# EasyEDA Pro project ProProject_EdgDbg-v1_2024-04-02.epro

# Schematic st-link  v2-1_1
Create Date: 2024-04-01; Page Name: ST-LINK V2-1; Project Name: EdgDbg-v1; Schematic Name: st-link  v2-1_1; Update Date: 2024-04-01; Company: 攻城狮晨哲; Drawed: 沈工; Page Size: A4; Part Number: PCB-002; Reviewed: 沈工; Version: V2.0.1
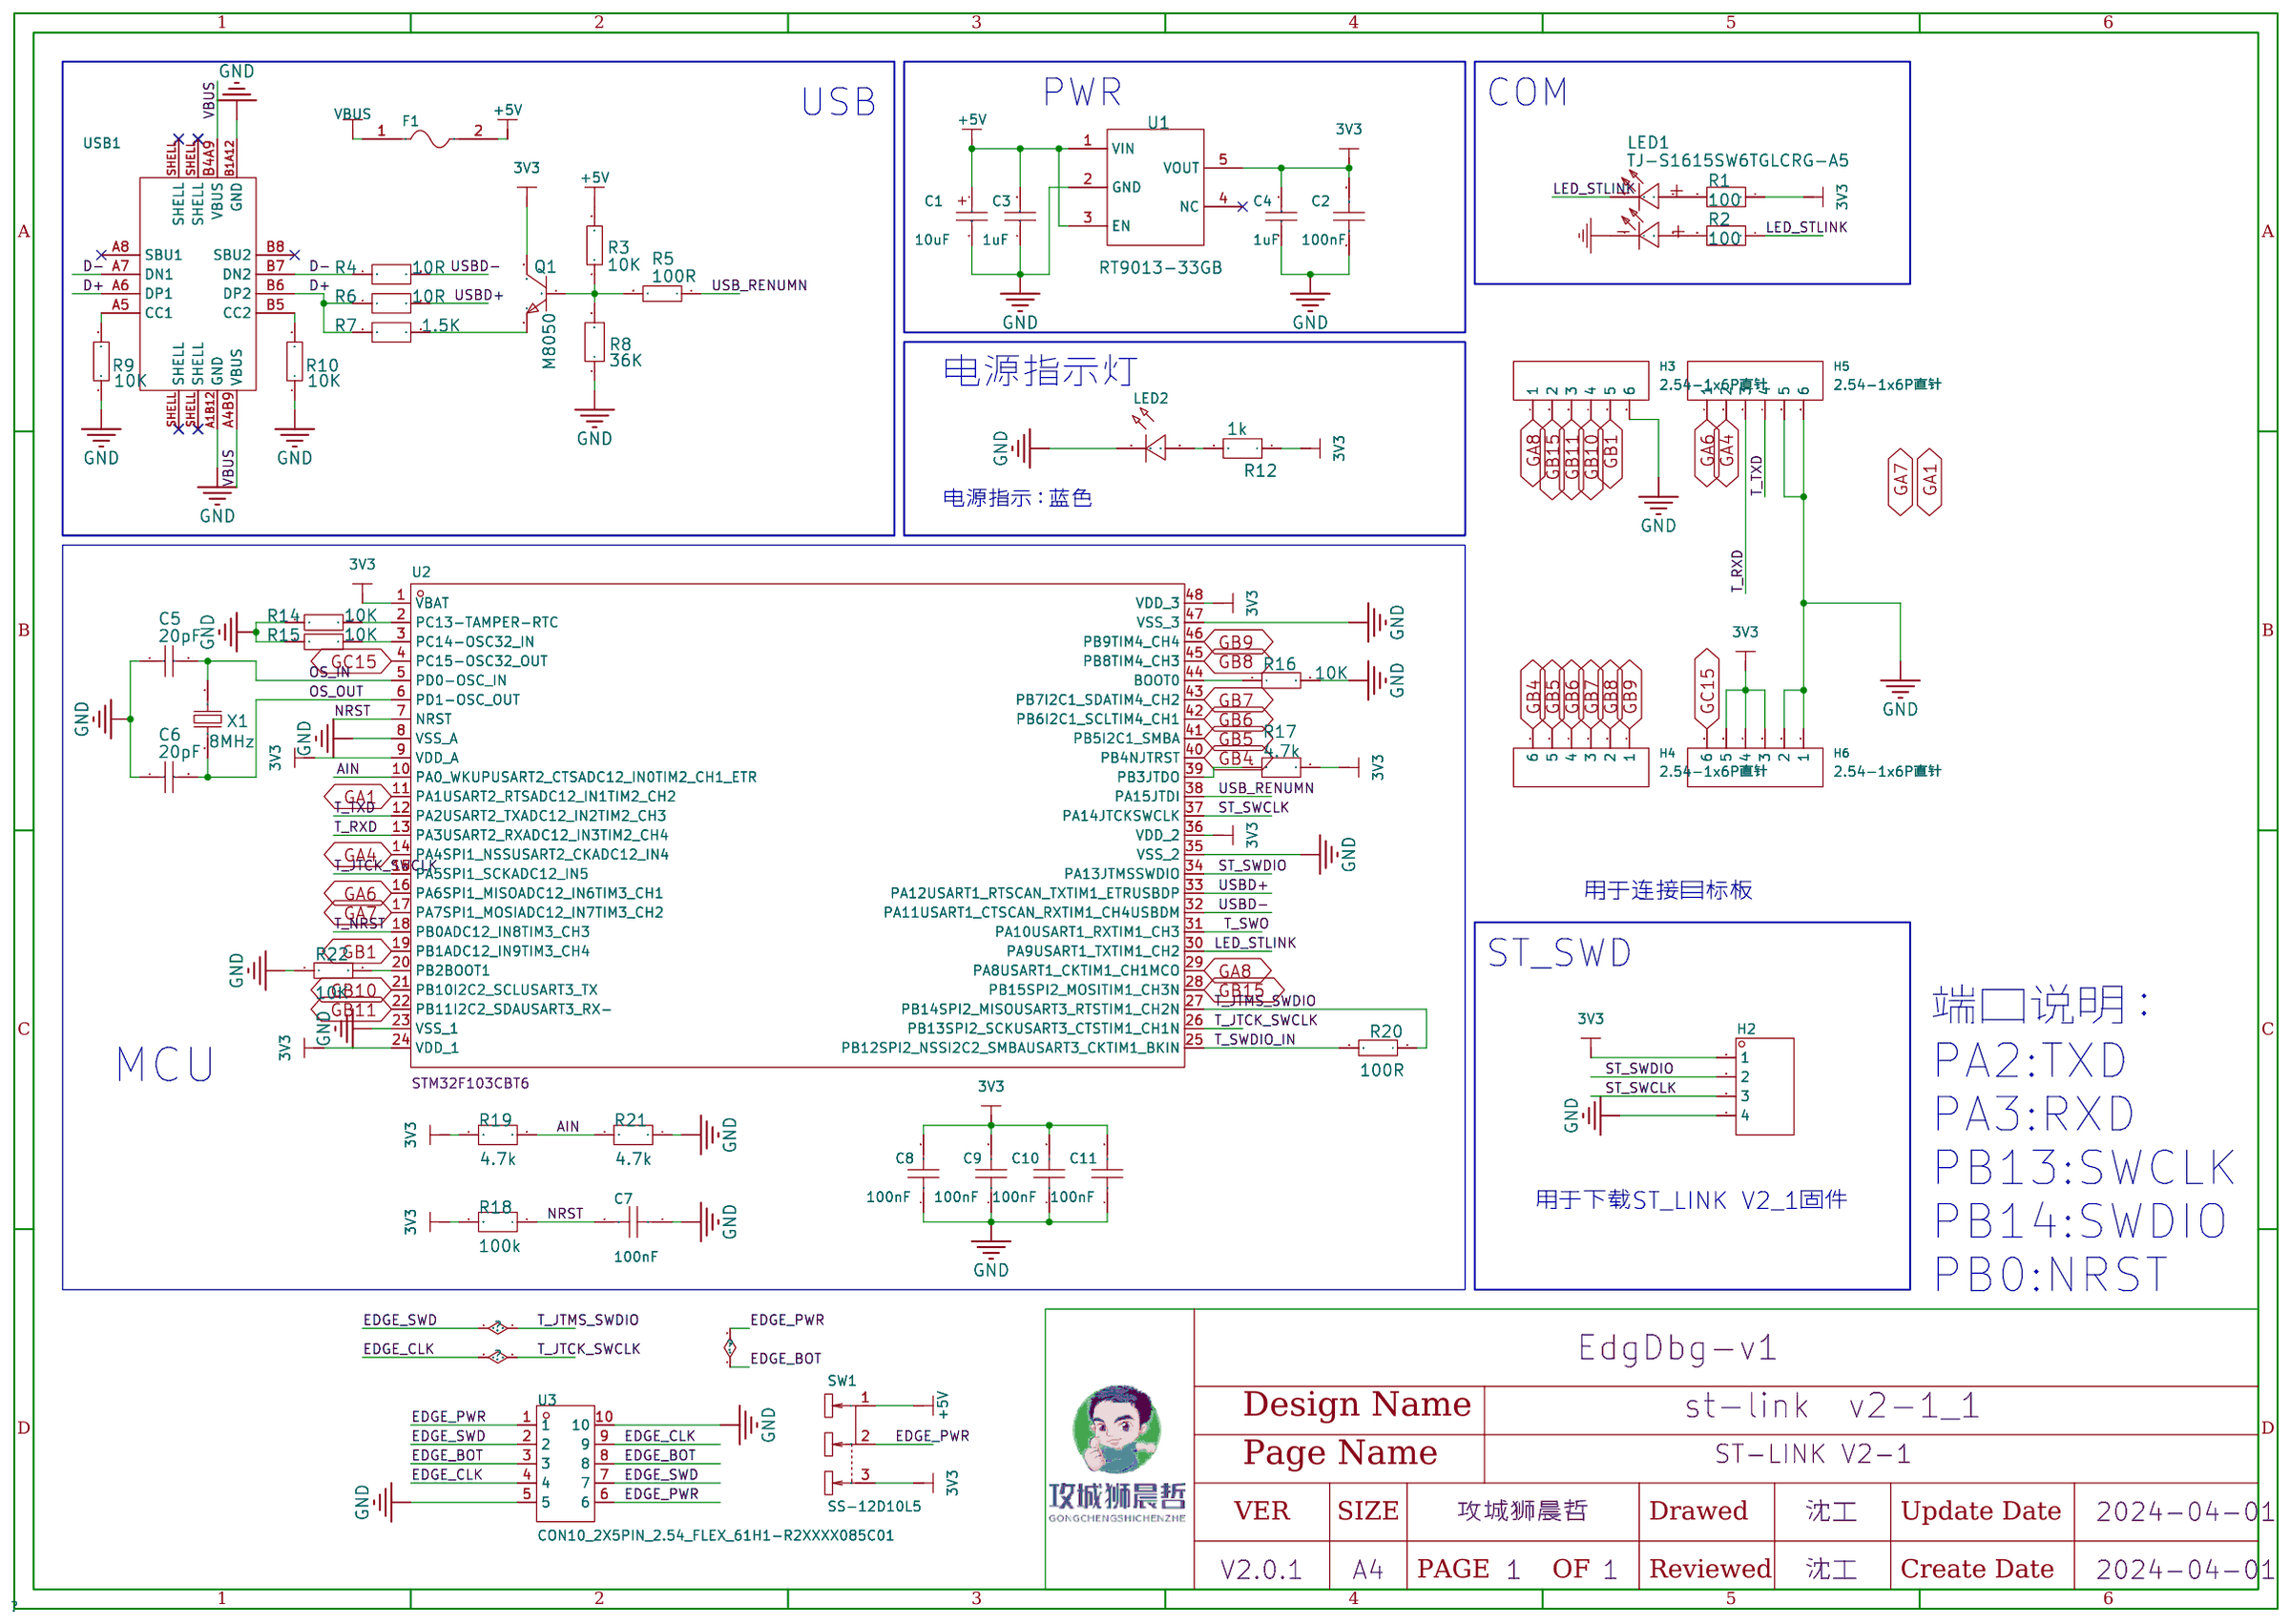
[diagram p0: schematic sheet]

## Parts
C1  10uF  [CASE-A_3216]
C2  100nF  [C0603]
C3  1uF  [C0603]
C4  1uF  [C0603]
C5  20pF  [C0603]
C6  20pF  [C0603]
C7  100nF  [C0603]
C8  100nF  [C0603]
C9  100nF  [C0603]
C10  100nF  [C0603]
C11  100nF  [C0603]
F1  nSMD050  [F1206]
H2  -  [HDR-TH_4P-P2.54-V-M]
H3  2.54-1x6P直针  [HDR-TH_6P-P2.54-V-M-1]
H4  2.54-1x6P直针  [HDR-TH_6P-P2.54-V-M-1]
H5  2.54-1x6P直针  [HDR-TH_6P-P2.54-V-M-1]
H6  2.54-1x6P直针  [HDR-TH_6P-P2.54-V-M-1]
LED1  TJ-S1615SW6TGLCRG-A5  [LED-ARRAY-SMD_4P-L1.6-W1.5-TR-RD_TJ-S1615SW6TGLCRB-A5]
LED2  -  [LED0603]
Q1  M8050  [SOT-23(SOT-23-3)]
R1  100  [R0603]
R2  100  [R0603]
R3  10K  [R0603]
R4  10R  [R0603]
R5  100R  [R0603]
R6  10R  [R0603]
R7  1.5K  [R0603]
R8  36K  [R0603]
R9  10K  [R0603]
R10  10K  [R0603]
R12  1k  [R0603]
R14  10K  [R0603]
R15  10K  [R0603]
R16  10K  [R0603]
R17  4.7k  [R0603]
R18  100k  [R0603]
R19  4.7k  [R0603]
R20  100R  [R0603]
R21  4.7k  [R0603]
R22  10K  [R0603]
SW1  SS-12D10L5  [SW-TH_SS-12D10L5]
U1  RT9013-33GB  [SOT-23-5_L3.0-W1.7-P0.95-LS2.8-BR]
U2  -  [LQFP-48_L7.0-W7.0-P0.50-LS9.0-BL]
U3  CON10_2X5PIN_2.54_FLEX_61H1-R2XXXX085C01  [CONN-TH_10P-P2.54-2X5PIN_2.54_FLEX_61H1]
USB1  -  [USB-3.1-SMD_U262-161N-4BVC11]
X1  8MHz  [OSC-SMD_L5.0-W3.2]

## Library data of the parts
C1 = TAJA106K016RNJ: 容值:10uF;精度:±10%;额定电压:16V;等效串联电阻:3Ω@100kHz;工作温度:-55~+125;; LCSC Part Name: 10uF ±10% 16V; Supplier Part: C7171; Manufacturer: Kyocera AVX; JLCPCB Part Class: Basic Part; Datasheet: https://atta.szlcsc.com/upload/public/pdf/source/20160107/1457707748093.pdf; Supplier: LCSC; Tolerance: ±10%; Rated Voltage: 16V; Equivalent Series Resistance(ESR): 3Ω@100kHz; Operating Temperature: -55~+125
C2 C7-C11 = CC0603KRX7R9BB104: 容值:100nF;精度:±10%;额定电压:50V;温度系数:X7R;; LCSC Part Name: 100nF ±10% 50V; Supplier Part: C14663; Manufacturer: YAGEO(国巨); Supplier Footprint: 0603; JLCPCB Part Class: Basic Part; Datasheet: https://atta.szlcsc.com/upload/public/pdf/source/20170116/1484561234239.pdf; Supplier: LCSC; Tolerance: ±10%; Voltage Rated: 50V; Temperature Coefficient: X7R
C3 C4 = CL10A105KB8NNNC: 容值:1uF;精度:±10%;额定电压:50V;温度系数:X5R;; LCSC Part Name: 1uF ±10% 50V; Supplier Part: C15849; Manufacturer: SAMSUNG(三星); Supplier Footprint: 0603; JLCPCB Part Class: Basic Part; Datasheet: https://atta.szlcsc.com/upload/public/pdf/source/20160103/1457707679084.pdf; Supplier: LCSC; Tolerance: ±10%; Voltage Rated: 50V; Temperature Coefficient: X5R
C5 C6 = 20pF: Supplier: LCSC; Manufacturer Part: CL10C220JB8NNNC; Manufacturer: SAMSUNG; Supplier Part: C1653
F1 = nSMD050: 最大电压:6V;最大电流:100A;保持电流:500mA;跳闸电流:1A;; LCSC Part Name: 0.5A 6V  自恢复保险丝; Supplier Part: C69688; Manufacturer: 台湾陆海; Supplier Footprint: 1206; JLCPCB Part Class: Extended Part; Datasheet: https://atta.szlcsc.com/upload/public/pdf/source/20160331/1459396375403.pdf; Supplier: LCSC; Operating Voltage (Max): 6V; Current Rating (Max): 100A; Hold Current: 500mA; Trip Current: 1A
H2 = B-2100S04P-A110: 间距:2.54mm;总PIN位数:4;排数:1;插针结构:1x4P;行距:-;安装类型:直插;圆针/方针:-;额定电流:-;额定电压:-;配合针长度:6mm;塑高:2.54mm;端接针长度:3mm;触头材质:黄铜;触头镀层:-;工作温度范围:-40~+105;颜色:黑色;; LCSC Part Name: 2.54mm 1x4P; Supplier Part: C124378; Manufacturer: Ckmtw(灿科盟); Supplier Footprint: 插件,P=2.54mm; JLCPCB Part Class: Extended Part; Datasheet: https://atta.szlcsc.com/upload/public/pdf/source/20170821/C124378_1503303307508901532.pdf; Supplier: LCSC; Pitch: 2.54mm; Number of Pins: 4; Number of Rows: 1; Pin Structure: 1x4P; Mounting Type: 直插; Length of Mating Pin: 6mm; Insulation Height: 2.54mm; Length of End Connection Pin: 3mm; Contact Material: 黄铜; Operating Temperature Range: -40~+105; Color: 黑色
H3-H6 = 2.54-1x6P直针: 插针结构:1x6P;间距:2.54mm;行距:-;圆针/方针:方针;安装类型:直插;排数:单排;总PIN位数:6P;额定电流:3A;额定电压:-;配合针长度:-;塑高:-;触头材质:黄铜;触头镀层:-;工作温度范围:-40℃~+105℃;颜色:黑色;; LCSC Part Name: 间距:2.54mm 1x6P 直插 方针; Supplier Part: C37208; Manufacturer: BOOMELE(博穆精密); Supplier Footprint: 插件,P=2.54mm; JLCPCB Part Class: 扩展库; Supplier: LCSC; Pin Structure: 1x6P; Pitch: 2.54mm; Circluar Pins/Square Pins: 方针; Mounting Type: 直插; Number of Rows: 单排; Number of Pins: 6P; Current Rating (Max): 3A; Contact Material: 黄铜; Operating Temperature Range: -40℃~+105℃; Color: 黑色
LED1 = TJ-S1615SW6TGLCRG-A5: Supplier: LCSC; Supplier Part: C273605; Manufacturer: TOGIALED
LED2 = LED-0603-B
Q1 = M8050_C266599: Supplier: LCSC; Supplier Part: C266599; Manufacturer: Bourne Semicon (Shenzhen)
R1 R2 R12 = 1k: Manufacturer Part: RC0603FR-071KL; Supplier: LCSC; Manufacturer: YAGEO; Supplier Part: C22548
R3 R9 R10 R14-R16 R22 = 10K: Supplier: LCSC; Manufacturer: YAGEO; Manufacturer Part: AC0603FR-0710KL; Supplier Part: C116677
R4 R6 = 10R: Manufacturer Part: RC0603FR-0710RL; Supplier: LCSC; Manufacturer: YAGEO; Supplier Part: C109318
R5 R20 = 100R: Supplier: LCSC; Supplier Part: C105588; Manufacturer: YAGEO; Manufacturer Part: RC0603FR-07100RL
R7 = 1.5K: Manufacturer Part: RC0603FR-071K5L; Supplier: LCSC; Manufacturer: YAGEO; Supplier Part: C114668
R8 = 36K: Manufacturer Part: AC0603FR-0736KL; Supplier: LCSC; Manufacturer: YAGEO; Supplier Part: C227841
R17 R19 R21 = 4.7k: Manufacturer Part: AC0603FR-074K7L; Supplier: LCSC; Manufacturer: YAGEO; Supplier Part: C116697
R18 = 100k: Manufacturer Part: AC0603FR-07100KL; Supplier: LCSC; Manufacturer: YAGEO; Supplier Part: C116674
SW1 = SS-12D10L5: 电路结构:单刀双掷;安装方式:直插;开关颜色:黑色;额定电流(DC):3A;额定电压(DC):125V;额定电流(AC):3A;额定电压(AC):125V;机械寿命:1万次;; LCSC Part Name: 柄长5mm 直插双档 滑动开关; Supplier Part: C319012; Manufacturer: XKB Connectivity(中国星坤); Supplier Footprint: 插件; JLCPCB Part Class: 扩展库; Datasheet: https://atta.szlcsc.com/upload/public/pdf/source/20211009/D6412F37AABE6F9459A6EE7FA4DAEADB.pdf; Supplier: LCSC; Circuit: 单刀双掷; Actuator Style: 矩形柱状; Pin Style: PC引脚; Switch Length: 13mm; Switch Width: 6.8mm; Switch Height: 6.4mm; Mounting Style: 直插; Actuator Color: 黑色; Current Rating (DC): 3A; Voltage Rating (DC): 125V; Current Rating (AC): 3A; Voltage Rating (AC): 125V; Mechanical Life: 1万次; Operating Temperature: -40℃~+85℃
U1 = RT9013-33GB: Supplier: LCSC; Manufacturer: RICHTEK; image: //image.lceda.cn/szlcsc/C47773.jpg; Supplier Part: C47773
U2 = STM32F103CBT6: 主频（MAX):72MHz;工作电压:2V ~ 3.6V;; Supplier Part: C8304; Manufacturer: ST(意法半导体); Supplier Footprint: LQFP-48_7x7x05P; JLCPCB Part Class: Extended Part; Datasheet: https://atta.szlcsc.com/upload/public/pdf/source/20140724/1457707170379.pdf; Supplier: LCSC; Speed: 72MHz; Voltage - Supply (Vcc/Vdd): 2V ~ 3.6V; RAM Size: 20KB; Number of I/O: 37; A/D: 16x12bit; PWM: 13; UART/USART: 3 USART; I2C（SMBUS/PMBUS）: 2; USB Device: 1; CAN: 1
U3 = CON10_2X5PIN_2.54_FLEX_61H1-R2XXXX085C01: Supplier Part: C9900013345; Supplier Footprint: 2X5PIN_2.54_FLEX_61H1; JLCPCB Part Class: 扩展库; Supplier: LCSC
USB1 = U262-161N-4BVC11: 连接器类型:Type-C;标准:-;公母:母座;触点数量:16;端口数量:1;; LCSC Part Name: Type-C 母座; Supplier Part: C319148; Manufacturer: XKB Connectivity(中国星坤); Supplier Footprint: SMD; JLCPCB Part Class: Extended Part; Datasheet: https://atta.szlcsc.com/upload/public/pdf/source/20211015/B478CBA0F1623DA36A6CC6918C49C838.pdf; Supplier: LCSC; Connector Type: Type-C; Gender: 母座; Number of Contacts: 16; Number of Ports: 1
X1 = 8MHz: Supplier: LCSC; Manufacturer: TXC; Manufacturer Part: 7A0808LCSC-AHK2G; Supplier Part: C111120

## Nets
3V3: C2.2 C4.2 C8.2 C9.2 C10.2 C11.2 H2.1 H6.3 H6.4 H6.5 Q1.3(C) R1.1 R12.1 R17.1 R18.2 R19.2 SW1.3 U1.5(VOUT) U2.1(VBAT) U2.9(VDD_A) U2.24(VDD_1) U2.36(VDD_2) U2.48(VDD_3)
+5V: C1.1 C3.2 F1.2 R3.2 SW1.1 U1.1(VIN) U1.3(EN)
GND: C1.2 C2.1 C3.1 C4.1 C5.1 C6.1 C7.1 C8.1 C9.1 C10.1 C11.1 H2.4 H3.6 H5.5 H5.6 H6.1 H6.2 LED1.4 LED2.1(C) R8.1 R9.1 R10.1 R14.1 R15.1 R16.2 R21.1 R22.1 U1.2(GND) U2.8(VSS_A) U2.23(VSS_1) U2.35(VSS_2) U2.47(VSS_3) U3.5 U3.10 USB1.A1B12(GND) USB1.B1A12(GND)
VBUS: F1.1 USB1.A4B9(VBUS) USB1.B4A9(VBUS)
AIN: R19.1 R21.2 U2.10(PA0_WKUPUSART2_CTSADC12_IN0TIM2_CH1_ETR)
D+: R6.1 R7.1 USB1.A6(DP1) USB1.B6(DP2)
D-: R4.1 USB1.A7(DN1) USB1.B7(DN2)
EDGE_BOT: SW1.2 U3.1 U3.3 U3.6 U3.8
EDGE_CLK: U2.15(PA5SPI1_SCKADC12_IN5) U2.26(PB13SPI2_SCKUSART3_CTSTIM1_CH1N) U3.4 U3.9
EDGE_SWD: R20.1 U2.27(PB14SPI2_MISOUSART3_RTSTIM1_CH2N) U3.2 U3.7
GA1: U2.11(PA1USART2_RTSADC12_IN1TIM2_CH2)
GA4: H5.2 U2.14(PA4SPI1_NSSUSART2_CKADC12_IN4)
GA6: H5.1 U2.16(PA6SPI1_MISOADC12_IN6TIM3_CH1)
GA7: U2.17(PA7SPI1_MOSIADC12_IN7TIM3_CH2)
GA8: H3.1 U2.29(PA8USART1_CKTIM1_CH1MCO)
GB1: H3.5 U2.19(PB1ADC12_IN9TIM3_CH4)
GB4: H4.6 U2.40(PB4NJTRST)
GB5: H4.5 U2.41(PB5I2C1_SMBA)
GB6: H4.4 U2.42(PB6I2C1_SCLTIM4_CH1)
GB7: H4.3 U2.43(PB7I2C1_SDATIM4_CH2)
GB8: H4.2 U2.45(PB8TIM4_CH3)
GB9: H4.1 U2.46(PB9TIM4_CH4)
GB10: H3.4 U2.21(PB10I2C2_SCLUSART3_TX)
GB11: H3.3 U2.22(PB11I2C2_SDAUSART3_RX-)
GB15: H3.2 U2.28(PB15SPI2_MOSITIM1_CH3N)
GC15: H6.6 U2.4(PC15-OSC32_OUT)
LED_STLINK: LED1.2 R2.1 U2.30(PA9USART1_TXTIM1_CH2)
NRST: C7.2 R18.1 U2.7(NRST)
OS_IN: C5.2 U2.5(PD0-OSC_IN) X1.2
OS_OUT: C6.2 U2.6(PD1-OSC_OUT) X1.1
ST_SWCLK: H2.3 U2.37(PA14JTCKSWCLK)
ST_SWDIO: H2.2 U2.34(PA13JTMSSWDIO)
T_NRST: U2.18(PB0ADC12_IN8TIM3_CH3)
T_RXD: H5.3 U2.13(PA3USART2_RXADC12_IN3TIM2_CH4)
T_SWDIO_IN: R20.2 U2.25(PB12SPI2_NSSI2C2_SMBAUSART3_CKTIM1_BKIN)
T_SWO: U2.31(PA10USART1_RXTIM1_CH3)
T_TXD: H5.4 U2.12(PA2USART2_TXADC12_IN2TIM2_CH3)
USB_RENUMN: R5.1 U2.38(PA15JTDI)
USBD+: R6.2 U2.33(PA12USART1_RTSCAN_TXTIM1_ETRUSBDP)
USBD-: R4.2 U2.32(PA11USART1_CTSCAN_RXTIM1_CH4USBDM)
$1N38: R15.2 U2.3(PC14-OSC32_IN)
$1N350: Q1.2(E) R7.2
$1N367: Q1.1(B) R3.1 R5.2 R8.2
$1N516: R17.2 U2.39(PB3JTDO)
$1N517: R16.1 U2.44(BOOT0)
$1N690: LED2.2(A) R12.2
$1N8682: R9.2 USB1.A5(CC1)
$1N8780: R10.2 USB1.B5(CC2)
$1N17783: LED1.1 R1.2
$1N17836: LED1.3 R2.2
$1N45552: R14.2 U2.2(PC13-TAMPER-RTC)
$1N58058: R22.2 U2.20(PB2BOOT1)

Not connected (* = marked no-connect by the designer): U1 4(NC)*; USB1 A8(SBU1)* B8(SBU2)* SHELL*

## Notes on the sheet
- PWR
- COM
- USB
- 电源指示灯
- 电源指示：蓝色
- 用于连接目标板
- ST_SWD
- 端口说明：
  PA2:TXD
  PA3:RXD
  PB13:SWCLK
  PB14:SWDIO
  PB0:NRST
- MCU
- 用于下载ST_LINK V2_1固件

# Board ST-LINK  V2-1_1
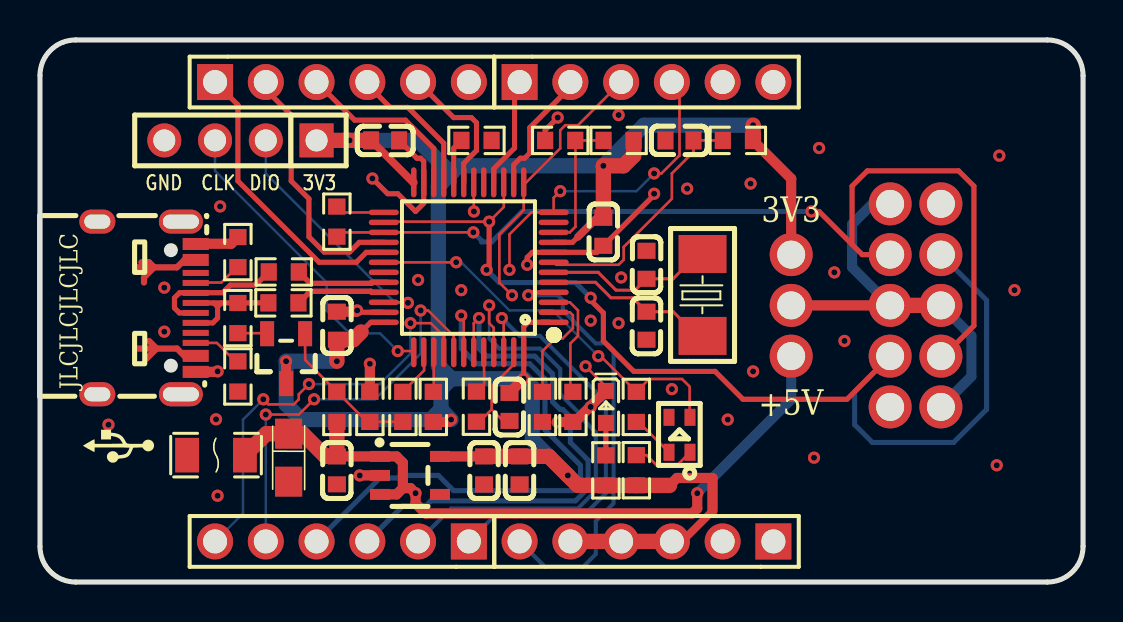
[diagram p1: board, top side]
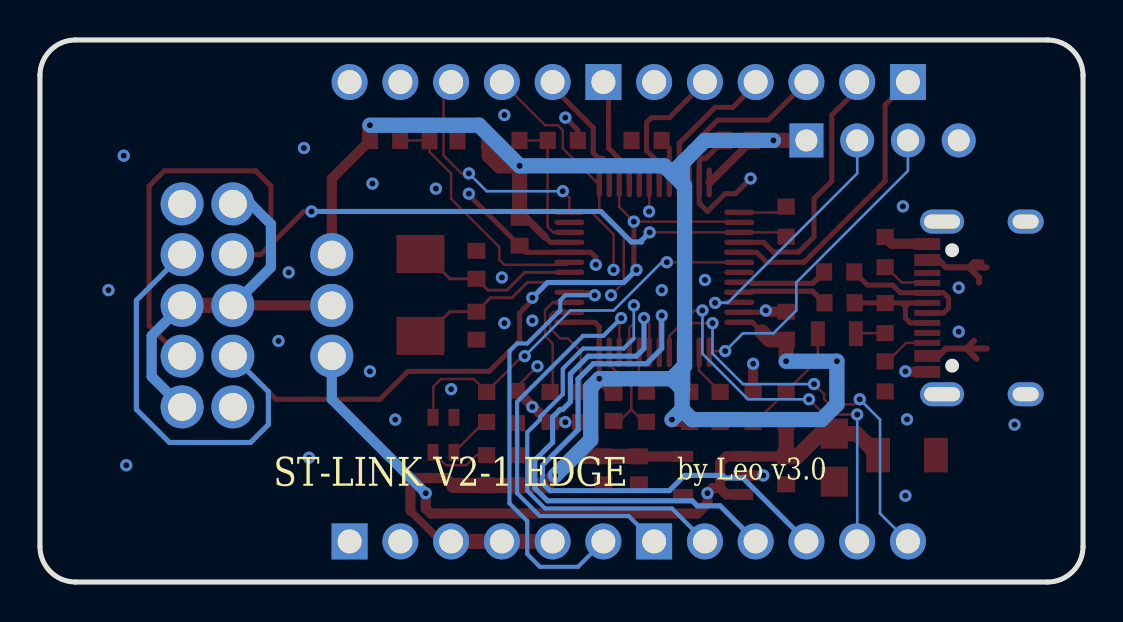
[diagram p2: board, bottom side, seen from below]

Outline 52.19 x 27.12 mm; copper layers: Top Layer, Bottom Layer. Coordinates in mm from the lower left corner of the outline.
Outline path: 0,25.35 0,1.78 arc(0.52,0.52) 1.78,0 50.42,0 arc(51.67,0.52) 52.19,1.78 52.19,25.35 arc(51.67,26.6) 50.42,27.12 1.78,27.12 arc(0.52,26.6) 0,25.35
Stack: Top Layer 0.035mm / Dielectric1 1.51mm FR4 er 4.5 / Bottom Layer 0.035mm

## Design rules (mm)
net USBD-: DP2_USB
net USBD+: DP2_USB
spacing W5 (default): track to track 0.127, other pairs 0.127 to 0.152
track width W5 (default): min 0.127, default 0.127, max 0.254
track width W10: min 0.127, default 0.254, max 2.54
track width W20: min 0.127, default 0.508, max 2.54
differential pair DIFF100 (default): width min 0.127, default 0.267, max 2.54; gap min 0.102, default 0.127
via via6-3 (default): diameter min 0.5, default 0.61, max 10; hole min 0.3, default 0.305, max 5.999
via via8-BGA-16: diameter min 0.406, default 0.406, max 0.406; hole min 0.203, default 0.203, max 0.203
via via8-4: diameter min 0.5, default 0.81, max 10; hole min 0.3, default 0.405, max 6
via VIA12-8: diameter min 0.5, default 1.199, max 10; hole min 0.3, default 0.8, max 5.999
net 3V3 uses W10
net VBUS uses VBUS, W20
net GND uses W20
net +5V uses W20

## Placement (name value [footprint] x y rotation side)
C1  10uF  [CASE-A_3216]  12.44 6.22 270 top
C2  100nF  [C0603]  24 5.59 90 top
C3  1uF  [C0603]  14.86 5.59 90 top
C4  1uF  [C0603]  22.22 5.59 90 top
C5  20pF  [C0603]  30.35 12.83 90 top
C6  20pF  [C0603]  30.35 15.88 270 top
C7  100nF  [C0603]  32 22.1 0 top
C8  100nF  [C0603]  28.19 17.53 90 top
C9  100nF  [C0603]  14.86 12.83 270 top
C10  100nF  [C0603]  23.49 8.76 90 top
C11  100nF  [C0603]  17.27 22.1 180 top
F1  nSMD050  [F1206]  8.81 6.35 0 top
H2  -  [HDR-TH_4P-P2.54-V-M]  10.03 22.1 180 top
H3  2.54-1x6P直针  [HDR-TH_6P-P2.54-V-M-1]  15.11 25.02 0 top
H4  2.54-1x6P直针  [HDR-TH_6P-P2.54-V-M-1]  15.11 2.03 180 top
H5  2.54-1x6P直针  [HDR-TH_6P-P2.54-V-M-1]  30.35 25.02 0 top
H6  2.54-1x6P直针  [HDR-TH_6P-P2.54-V-M-1]  30.35 2.03 180 top
LED1  TJ-S1615SW6TGLCRG-A5  [LED-ARRAY-SMD_4P-L1.6-W1.5-TR-RD_TJ-S1615SW6TGLCRB-A5]  32 7.37 270 top
LED2  -  [LED0603]  28.32 8.76 270 top
Q1  M8050  [SOT-23(SOT-23-3)]  12.32 9.91 180 top
R1  100  [R0603]  29.84 5.6 90 top
R2  100  [R0603]  29.84 8.76 270 top
R3  10K  [R0603]  14.86 8.76 270 top
R4  10R  [R0603]  12.2 15.52 0 top
R5  100R  [R0603]  18.16 8.76 270 top
R6  10R  [R0603]  12.18 13.97 0 top
R7  1.5K  [R0603]  9.9 13.21 270 top
R8  36K  [R0603]  16.51 8.76 270 top
R9  10K  [R0603]  9.9 16.51 270 top
R10  10K  [R0603]  9.9 10.29 90 top
R12  1k  [R0603]  28.32 5.59 90 top
R14  10K  [R0603]  25.14 8.76 90 top
R15  10K  [R0603]  26.67 8.76 90 top
R16  10K  [R0603]  21.84 8.77 270 top
R17  4.7k  [R0603]  19.68 8.76 90 top
R18  100k  [R0603]  34.92 22.1 0 top
R19  4.7k  [R0603]  28.95 22.1 0 top
R20  100R  [R0603]  14.86 18.03 90 top
R21  4.7k  [R0603]  26.03 22.1 0 top
R22  10K  [R0603]  21.84 22.1 180 top
SW1  SS-12D10L5  [SW-TH_SS-12D10L5]  37.59 13.84 90 top
U1  RT9013-33GB  [SOT-23-5_L3.0-W1.7-P0.95-LS2.8-BR]  18.52 5.33 180 top
U2  -  [LQFP-48_L7.0-W7.0-P0.50-LS9.0-BL]  21.45 15.75 90 top
U3  CON10_2X5PIN_2.54_FLEX_61H1-R2XXXX085C01  [CONN-TH_10P-P2.54-2X5PIN_2.54_FLEX_61H1]  45.08 13.84 0 top
USB1  -  [USB-3.1-SMD_U262-161N-4BVC11]  5.33 13.72 270 top
X1  8MHz  [OSC-SMD_L5.0-W3.2]  33.16 14.37 270 top

## Footprints (pads in the part's own frame, mm; a bottom-side part is the same pattern mirrored in y, then rotated)
C0603
  rect 0.8x0.9 smd: 1(-0.7,0) 2(0.7,0)
CASE-A_3216
  rect 1.5x1.359 smd: 1(-1.2,0) 2(1.2,0)
CONN-TH_10P-P2.54-2X5PIN_2.54_FLEX_61H1
  round 2.15 hole 1.4: 1(-2.54,5.08) 2(-2.54,2.54) 3(-2.54,0) 4(-2.54,-2.54) 5(-2.54,-5.08) 6(0,-5.08) 7(0,-2.54) 8(0,0) 9(0,2.54) 10(0,5.08)
F1206
  rect 1.192x1.727 smd: 1(-1.446,0) 2(1.446,0)
HDR-TH_4P-P2.54-V-M
  rect 1.7x1.7 hole 1.1: 1(-3.81,0)
  round 1.7 hole 1.1: 2(-1.27,0) 3(1.27,0) 4(3.81,0)
HDR-TH_6P-P2.54-V-M-1
  rect 1.8x1.8 hole 1.2: 1(-6.35,0)
  round 1.8 hole 1.2: 2(-3.81,0) 3(-1.27,0) 4(1.27,0) 5(3.81,0) 6(6.35,0)
LED0603
  rect 0.8x0.8 smd: 1(-0.799,-0.004) 2(0.799,0.004)
LED-ARRAY-SMD_4P-L1.6-W1.5-TR-RD_TJ-S1615SW6TGLCRB-A5
  rect 0.85x0.55 smd: 1(0.875,0.525) 2(-0.875,0.525) 3(0.875,-0.525) 4(-0.875,-0.525)
LQFP-48_L7.0-W7.0-P0.50-LS9.0-BL
  oval 0.27x1.5 smd: 1(-2.75,-4.25) 2(-2.25,-4.25) 3(-1.75,-4.25) 4(-1.25,-4.25) 5(-0.75,-4.25) 6(-0.25,-4.25) 7(0.25,-4.25) 8(0.75,-4.25) 9(1.25,-4.25) 10(1.75,-4.25) 11(2.25,-4.25) 12(2.75,-4.25) 25(2.75,4.25) 26(2.25,4.25) 27(1.75,4.25) 28(1.25,4.25) 29(0.75,4.25) 30(0.25,4.25) 31(-0.25,4.25) 32(-0.75,4.25) 33(-1.25,4.25) 34(-1.75,4.25) 35(-2.25,4.25) 36(-2.75,4.25)
  oval 1.5x0.27 smd: 13(4.25,-2.75) 14(4.25,-2.25) 15(4.25,-1.75) 16(4.25,-1.25) 17(4.25,-0.75) 18(4.25,-0.25) 19(4.25,0.25) 20(4.25,0.75) 21(4.25,1.25) 22(4.25,1.75) 23(4.25,2.25) 24(4.25,2.75) 37(-4.25,2.75) 38(-4.25,2.25) 39(-4.25,1.75) 40(-4.25,1.25) 41(-4.25,0.75) 42(-4.25,0.25) 43(-4.25,-0.25) 44(-4.25,-0.75) 45(-4.25,-1.25) 46(-4.25,-1.75) 47(-4.25,-2.25) 48(-4.25,-2.75)
OSC-SMD_L5.0-W3.2
  rect 1.9x2.4 smd: 1(-2.05,0) 2(2.05,0)
R0603
  rect 0.806x0.864 smd: 1(-0.753,0) 2(0.753,0)
SOT-23(SOT-23-3)
  rect 0.7x1.25 smd: 1(-0.95,-2.519) 2(0.95,-2.519) 3(0,-0.021)
SOT-23-5_L3.0-W1.7-P0.95-LS2.8-BR
  rect 1x0.55 smd: 1(1.5,-0.95) 2(1.5,0) 3(1.5,0.95) 4(-1.5,0.95) 5(-1.5,-0.95)
SW-TH_SS-12D10L5
  round 2.15 hole 1.4: 1(-2.54,0) 2(0,0) 3(2.54,0)
USB-3.1-SMD_U262-161N-4BVC11
  rect 0.6x1.3 smd: A1B12(-3.2,2.462) A4B9(-2.4,2.462) B1A12(3.2,2.462) B4A9(2.4,2.462)
  rect 0.3x1.3 smd: A5(-1.25,2.462) A6(-0.25,2.462) A7(0.25,2.462) A8(1.25,2.462) B5(1.75,2.462) B6(0.75,2.462) B7(-0.75,2.462) B8(-1.75,2.462)
  oval 1.2x2.2 hole 0.7x1.8: SHELL(-4.32,1.719) SHELL(4.32,1.719)
  oval 1.2x1.8 hole 0.7x1.3: SHELL(-4.32,-2.462) SHELL(4.32,-2.462)

## Nets
As in the schematic.

Pads without a net: U1 4; USB1 A8 B8 SHELL

## Via types
v1: diameter 0.61, hole 0.305, Top Layer to Bottom Layer, 70 vias

## Routing (per net, layer and track width the routed paths; a pad name or vN(x,y) marks a point on that pad's centre or on a via; arc(x,y) is an arc through that point)
3V3: length 115.6
  Top Layer w0.254: 25.51,13 24.43,13 24.2,12.78 U2.48 v1(24.2,10.17) ; U2.9 26.65,17 26.92,17.27 ; 17.41,13 17.41,12.99 16.55,12.99 16.07,12.52
  Top Layer w0.381: 26.92,17.27 27.81,18.16 28.13,18.16 C8.2 ; C11.2 18.67,20 U2.24 ; 31.62,2.03 32.13,2.03 33.65,3.56
  Top Layer w0.508: 33.65,3.56 33.65,5.21 31.87,5.21 31.5,4.83 ; SW1.3 37.59,20.18 R18.2 ; C10.2 v1(24.2,10.17) ; C4.2 22.22,6.28 U1.5 ; R17.1 20.45,8.01 v1(20.57,8.13) ; v1(12.32,11.05) Q1.3
  Top Layer w0.762: v1(14.86,11.05) C9.2 15.68,12.13 16.07,12.52 ; H6.5 H6.4 31.62,2.03 ; R18.2 35.68,22.11 v1(35.68,22.86) ; H2.1 v1(15.49,22.1) C11.2 ; R19.2 29.71,21.33 29.2,20.83 v1(28.19,20.83) C8.2 ; 29.83,4.83 29.84,4.84 ; 29.83,4.83 31.5,4.83 ; 29.83,4.83 R12.1 28.31,4.84 26.91,4.84 v1(26.41,5.33) 25.46,6.29 C2.2 C4.2
  Bottom Layer w0.762: 20.04,19.91 20.04,20.98 ; 20.04,19.91 20.57,20.45 ; 20.04,19.91 19.94,19.81 19.94,10.82 20.04,10.72 ; 20.04,20.98 20.57,20.45 ; 20.04,20.98 18.92,22.1 v1(15.49,22.1) ; 20.58,10.17 v1(24.2,10.17) 24.64,9.74 24.64,7.11 v1(26.41,5.33) ; 20.58,10.17 20.04,10.72 ; 20.58,10.17 20.04,9.63 ; v1(14.86,11.05) v1(12.32,11.05) 12.32,8.89 13.08,8.13 19.56,8.13 20.06,8.64 ; 20.57,20.45 20.95,20.83 v1(28.19,20.83) 30.22,22.86 v1(35.68,22.86) ; 20.06,8.64 20.06,9.6 20.04,9.63 ; 20.06,8.64 v1(20.57,8.13) ; 20.04,10.72 20.04,9.63
+5V: length 38.3
  Top Layer w0.508: 18.16,4.7 18.54,4.7 v1(18.79,4.45) 18.79,3.94 19.3,3.43 32.64,3.43 32.89,3.68 v1(32.89,4.45) ; 18.16,4.7 17.84,4.38 U1.3 ; 18.16,4.7 18.16,5.97 17.84,6.28 U1.1 14.99,6.28
  Top Layer w0.762: R3.2 C3.2 14.28,6.29 13.15,7.42 C1.1 11.33,7.42 10.25,6.35
  Bottom Layer w0.508: SW1.1 37.59,9.14 v1(32.89,4.45)
GND: length 35
  Top Layer w0.127: 22.6,8.64 23.18,8.06 C10.1 ; 22.6,8.64 21.99,8.02 R16.2 ; 22.6,8.64 22.6,9.78 23.7,10.88 U2.47 ; LED2.1 28.31,9.78 v1(27.3,10.8)
  Top Layer w0.254: U2.35 15.96,13.5 v1(15.87,13.59) ; v1(25.91,23.24) 25.28,22.61 R21.1 ; v1(16.63,20.19) 17.4,19.43 17.9,19.43 18.79,18.54 19.2,18.95 U2.23 19.2,21.05 19.05,21.21 18.86,21.21 C11.1 ; v1(24.38,15.88) 24.38,16.24 24.64,16.5 U2.8 27.86,16.5 C8.1 30.73,19.37 v1(30.73,19.43)
  Top Layer w0.508: 7.81,10.52 8.86,10.52 v1(8.89,10.54) ; LED2.1 27.56,8.8 v1(27.56,8.76) 27.52,8.76 26.76,8.01 25.91,8.01 v1(25.91,8) ; v1(16,5.33) U1.2 ; v1(15.87,13.59) 15.81,13.53 C9.1 ; 7.87,16.93 9.57,16.93 R9.1 ; v1(16.51,10.92) R8.1
  vias: v1(3.43,7.87) v1(6.22,14.73) v1(6.22,12.53) v1(8.81,8.14) v1(8.89,4.32) v1(9.01,18.8) v1(18.92,15.11) v1(21.08,14.61) v1(27.56,13.08) v1(28.95,23.37) v1(28.95,12.95) v1(29.08,15.24) v1(31.62,9.65) v1(32.38,19.69) v1(34.41,8.13) v1(35.56,19.94) v1(35.68,10.54) v1(38.73,6.22) v1(38.99,21.72) v1(39.75,15.49) v1(40.26,12.06) v1(47.88,5.84) v1(48,21.34) v1(48.77,14.61)
VBUS: length 9.3
  Top Layer w0.305: 5.71,15.75 5.46,16 5.08,16 ; 5.71,15.75 5.2,15.24 5.2,14.99 ; 5.71,15.75 4.82,15.75 ; 5.71,15.75 6.86,15.75 7.24,16.13 7.87,16.13 ; 4.82,11.68 5.84,11.68 ; 5.84,11.68 6.86,11.68 7.22,11.32 USB1.B4A9 ; 5.84,11.68 5.33,11.18 ; 5.84,11.68 5.46,12.06
AIN: length 6.9
  Top Layer w0.127: R19.1 R21.2 26.79,22.09 26.79,17.78 26.51,17.5 U2.10
D+: length 5.9
  Top Layer w0.254: 8.7,13.97 9.08,13.97 ; 8.7,13.97 7.81,13.97 ; 8.7,13.97 8.89,13.77 ; 9.08,13.97 8.89,13.77 ; 9.08,13.97 9.9,13.97 R7.1 9.91,13.97 R6.1 ; 8.89,13.77 8.89,13.21 8.65,12.97 7.81,12.97
D-: length 6.9
  Top Layer w0.254: 11.45,15.52 10.79,14.86 9.52,14.86 9.14,14.48 6.99,14.48 6.73,14.22 6.73,13.72 6.98,13.47 7.81,13.47
EDGE_BOT: length 21
  Top Layer w0.508: SW1.2 U3.3
  Top Layer w0.762: U3.3 U3.8
  Bottom Layer w0.508: U3.8 46.61,12.32 46.61,10.29 U3.6 ; U3.3 40.64,15.75 40.64,17.91 41.65,18.92 U3.1
EDGE_CLK: length 55
  Top Layer w0.127: 17.41,18 17.45,18.03 v1(22.48,18.03) 23.21,18.77 23.21,19.99 U2.15
  Top Layer w0.254: v1(27.56,14.22) 27.56,14.1 28.19,13.46 28.19,12.06 29.72,10.54 33.78,10.54 35.18,9.14 40.38,9.14 U3.4 ; v1(22.35,15.62) 22.48,15.75 v1(22.48,18.03)
  Bottom Layer w0.254: v1(22.35,15.62) 22.98,14.99 26.79,14.99 v1(27.56,14.22) ; U3.9 47.37,14.1 47.37,8.64 45.72,6.98 41.65,6.98 40.76,7.87 40.76,9.53 U3.4
EDGE_SWD: length 48.5
  Top Layer w0.127: v1(21.69,17.5) 17.41,17.5 17.41,17.49 15.07,17.49 R20.1
  Top Layer w0.254: 40.64,16.89 40.64,19.81 41.4,20.57 45.97,20.57 46.73,19.81 46.73,12.83 45.21,11.3 U3.7 ; 40.64,16.89 41.15,16.38 U3.2 ; 40.64,16.89 38.99,18.54 v1(38.61,18.54)
  Bottom Layer w0.254: v1(21.69,17.5) 22.1,17.09 22.1,17.02 22.6,17.02 24.13,18.54 v1(38.61,18.54)
GA4: length 6.3
  Top Layer w0.254: U2.14 23.7,20.88 24.04,21.21 24.25,21.21 24.51,21.46 24.51,22.73 26.54,24.77 H5.2
GA6: length 5.6
  Top Layer w0.254: U2.16 22.7,20.67 23.75,21.72 23.75,24.77 H5.1
GA8: length 14.6
  Top Layer w0.254: U2.29 16.33,16.5 15.83,16 13.97,16 9.9,20.07 9.9,23.88 H3.1
GB1: length 7
  Top Layer w0.254: U2.19 21.2,20.95 21.84,21.59 21.84,22.99 21.59,23.24 20.7,23.24 H3.5
GB4: length 21.1
  Top Layer w0.127: v1(11.17,9.14) 11.43,8.89 12.7,8.89 12.95,9.14 12.95,9.4 v1(13.46,9.91) ; U2.40 20.2,12.31 19.56,12.95 v1(18.54,12.95)
  Bottom Layer w0.127: H4.6 10.16,3.43 10.16,8.13 v1(11.17,9.14) ; v1(18.54,12.95) 18.54,11.43 17.02,9.91 v1(13.46,9.91)
GB5: length 20.5
  Top Layer w0.127: v1(11.3,8.38) 12.95,8.38 v1(13.71,9.14) ; v1(19.05,13.59) 19.43,13.59 20.7,12.31 U2.41
  Bottom Layer w0.127: v1(13.71,9.14) 16.76,9.14 19.05,11.43 v1(19.05,13.59) ; v1(11.3,8.38) H4.5
GB6: length 29.4
  Top Layer w0.127: v1(21.08,13.34) 21.2,13.21 U2.42
  Bottom Layer w0.254: H4.4 17.02,5.21 17.9,5.21 18.03,5.33 19.94,5.33 20.7,4.57 26.67,4.57 27.05,4.95 27.05,5.84 25.27,7.62 25.27,10.16 24.51,10.92 21.84,10.92 21.08,11.68 v1(21.08,13.34)
GB7: length 26.2
  Top Layer w0.127: U2.43 21.7,12.94 v1(21.97,13.21)
  Bottom Layer w0.254: v1(21.97,13.21) 21.97,11.68 22.35,11.3 24.76,11.3 25.65,10.41 25.65,9.02 26.03,8.64 26.16,8.64 26.54,8.26 26.54,6.98 27.43,6.1 27.43,4.7 26.79,4.06 19.56,4.06 19.3,3.81 18.16,3.81 H4.3
GB8: length 25.1
  Top Layer w0.127: v1(22.48,13.84) 22.48,12.95 22.7,12.73 U2.45
  Bottom Layer w0.127: v1(22.48,13.84) 22.48,12.19
  Bottom Layer w0.203: H4.2 20.57,3.68 26.92,3.68 27.81,4.57 27.81,7.49 27.18,8.13 27.18,8.26 26.03,9.4 26.03,10.67 25.02,11.68 22.98,11.68 22.48,12.19
GB9: length 21.1
  Top Layer w0.127: v1(23.11,13.21) 23.2,13.12 U2.46
  Bottom Layer w0.203: H4.1 22.73,3.3 27.18,3.3 28.32,4.45 28.32,9.02 25.02,12.32 24,12.32 v1(23.11,13.21)
GB10: length 7.1
  Top Layer w0.254: H3.4 16.38,24.89 17.52,23.75 18.41,23.75 20.2,21.96 U2.21
GB11: length 8.9
  Top Layer w0.254: U2.22 19.7,21.7 18.29,23.11 15.75,23.11 H3.3
GB15: length 12.9
  Top Layer w0.254: H3.2 11.3,24.64 12.57,23.37 12.57,20.07 13.46,19.18 13.46,17.27 14.22,16.51 15.49,16.51 15.98,17 U2.28
GC15: length 22.2
  Top Layer w0.203: v1(24.44,14.35) 24.58,14.5 U2.4
  Bottom Layer w0.203: v1(24.44,14.35) 25.91,14.35 26.16,14.1 26.16,13.59 27.81,11.94 28.32,11.94 28.7,11.56 28.7,3.94 27.81,3.05 27.81,1.4 27.18,0.76 25.27,0.76 H6.6
LED_STLINK: length 19.8
  Top Layer w0.127: v1(20.83,16) 20.82,16 17.41,16 ; LED1.2 32.51,8.26 32.51,9.78 32.13,10.16 30.49,10.16 R2.1 28.06,11.3 v1(27.94,11.3)
  Bottom Layer w0.127: v1(27.94,11.3) 25.65,13.59 23.49,13.59 21.08,16 v1(20.83,16)
NRST: length 12.5
  Top Layer w0.127: U2.7 25.83,15.88 28.95,15.88 29.21,16.13 29.21,16.76 31.62,19.18 31.62,20.45 32.7,21.53 C7.2 R18.1
OS_IN: length 8.6
  Top Layer w0.152: 33.16,12.31 32.89,12.31 31.68,13.53 C5.2 29.65,14.22 28.57,14.22 27.8,15 U2.5
OS_OUT: length 8.6
  Top Layer w0.152: U2.6 27.93,15.5 28.83,14.61 29.78,14.61 C6.2 31.68,15.17 32.92,16.42 X1.1
ST_SWCLK: length 16
  Top Layer w0.127: 18.71,11.56 v1(17.9,11.56)
  Bottom Layer w0.127: H2.3 8.76,20.57 14.35,14.99 14.35,13.59 15.49,12.45 17.02,12.45 v1(17.9,11.56)
ST_SWDIO: length 12.7
  Top Layer w0.127: U2.34 18.38,14 v1(18.41,13.97)
  Bottom Layer w0.127: 11.3,22.1 11.3,20.45 17.78,13.97 v1(18.41,13.97)
T_NRST: length 1.5
  Top Layer w0.127: v1(21.71,18.54) 21.7,18.55 U2.18
T_RXD: length 13.9
  Top Layer w0.127: v1(23.62,14.35) 22.98,14.99 22.98,17.4 24.2,18.62 U2.13 24.33,20 26.03,21.7 26.03,22.61 26.29,22.86 26.92,22.86 H5.3
T_SWDIO_IN: length 2.7
  Top Layer w0.127: R20.2 14.86,18.79 15.16,18.49 17.41,18.49 17.41,18.5
T_TXD: length 16.2
  Top Layer w0.127: v1(23.49,15.62) 23.49,17.4 24.59,18.5 U2.12 25.7,19.23 v1(26.03,19.56) ; 31.62,25.02 32,24.64 32,21.35 31.1,20.45 v1(30.73,20.45)
  Bottom Layer w0.127: v1(26.03,19.56) 29.84,19.56 v1(30.73,20.45)
USB_RENUMN: length 2.6
  Top Layer w0.127: 19.21,11.7 19.22,11.69 19.22,10.59 18.16,9.53 R5.1
USBD+: length 4.7
  Top Layer w0.267: R6.2 12.95,13.97 13.53,14.55 16.56,14.55 16.61,14.5 17.41,14.5
USBD-: length 4.7
  Top Layer w0.267: 17.41,15 16.65,15 16.59,14.95 13.53,14.95 12.95,15.52
$1N38: length 5.7
  Top Layer w0.127: U2.3 26.52,14 26.92,13.59 26.92,12.32 26.54,11.94 26.54,9.64 R15.2
$1N350: length 1.5
  Top Layer w0.127: Q1.2 11.32,12.43 11.29,12.45 R7.2
$1N367: length 7.5
  Top Layer w0.127: R5.2 R8.2 16.37,8.01 14.87,9.52 R3.1 14.86,9.53 13.27,11.12 Q1.1
$1N516: length 2
  Top Layer w0.127: R17.2 19.7,9.54 U2.39
$1N517: length 2.3
  Top Layer w0.127: 22.21,11.7 22.22,11.69 22.22,9.91 R16.1
$1N690: length 1.6
  Top Layer w0.254: 28.32,7.96 28.32,7.96 R12.2
$1N8682: length 2.4
  Top Layer w0.127: 7.87,14.98 7.88,14.99 9.07,14.99 9.84,15.76 R9.2
$1N8780: length 2.5
  Top Layer w0.127: 7.81,11.97 8.85,11.97 9.78,11.04 9.9,11.04
$1N17783: length 3.2
  Top Layer w0.127: R1.2 30.35,6.35 30.86,5.84 31.88,5.84 LED1.1
$1N17836: length 2.3
  Top Layer w0.127: R2.2 29.96,8.01 LED1.3
$1N45552: length 5.7
  Top Layer w0.127: U2.2 26.52,13.5 26.67,13.35 26.67,12.7 26.16,12.19 25.78,12.19 25.14,11.56 R14.2
$1N58058: length 2.3
  Top Layer w0.254: R22.2 20.7,21.71 U2.20

## Copper pours and planes (outline as drawn; the poured copper is in the pictures)
GND on Top Layer: -1.53,27.43 53.34,27.43 53.34,-0.38 -1.53,-0.38
GND on Bottom Layer: -0.38,28.58 52.45,28.58 52.45,-1.52 -0.38,-1.52
VBUS on Top Layer: 4.19,5.46 4.19,16.13 5.59,16.13 5.59,8.02 6.36,7.24 7.92,7.24 7.92,5.46

## Text on the board
Bottom Silkscreen Layer: by Leo v3.0 | ST-LINK V2-1 EDGE
Top Silkscreen Layer: GND | CLK | DIO | 3V3 | JLCJLCJLCJLC | +5V
Drill Drawing Layer: Mark | Count | 2 | 4 | 106 | Size | 27.6x51.2mil(0.700x1.300mm) | 27.6x70.9mil(0.700x1.800mm) | 43.3x43.3mil(1.100x1.100mm) | 12.0mil(0.305mm) | Plated | PTH | Shape | Slot | Round | Via/Pad | Pad | Via | Pad Shape | Oval | (Mixed) | Layer Pair | Top Layer-Bottom Layer
